# Altium schematic sheet V1.0.SchDoc
size 254 x 101 mm; PageSetup: Record=PageOptions|CenterHorizontal=True|CenterVertical=True|PrintScale=0.71|XCorrection=1.00|YCorrection=1.00|PrintKind=1|BorderSize=5000000|LeftOffset=0|BottomOffset=0|Orientation=2|PaperLength=1000|PaperWidth=1000|Scale=100|PaperSource=15|PrintQuality=4000|MediaType=1|DitherType=10|PrintScaleMode=1|PaperKind=A4|PaperIndex=9
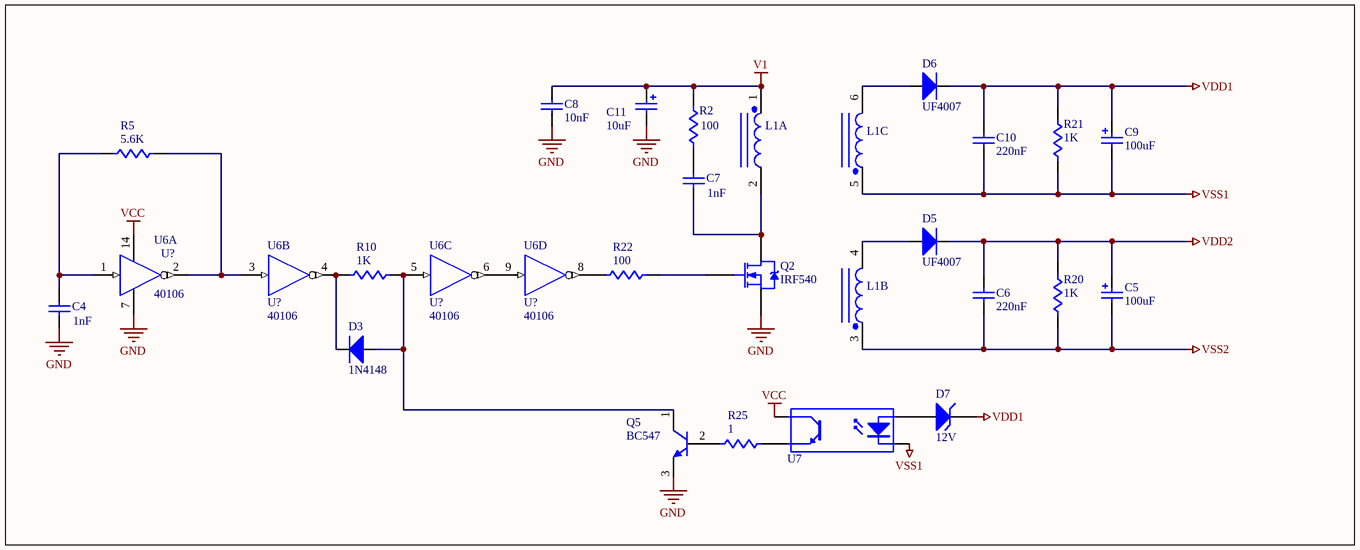
[diagram p0: V1.0.SchDoc]

## Parts
C4  value 1nF  [CAPNTO2.54-3.05x1.78A]  (hidden comment: Cap)
C5  value 100uF  [CAPPR2.5-6.3x5]  (hidden comment: Cap Pol1)
C6  value 220nF  [CAPNTO5.08-7.37x3.94]  (hidden comment: Cap)
C7  value 1nF  [CAPNTO2.54-3.56x2.03]  (hidden comment: Cap)
C8  value 10nF  [CAPNTO2.54-3.05x1.78A]  (hidden comment: Cap)
C9  value 100uF  [CAPPR2.5-6.3x5]  (hidden comment: Cap Pol1)
C10  value 220nF  [CAPNTO5.08-7.37x3.94]  (hidden comment: Cap)
C11  value 10uF  [CAPPR2.5-6.3x5]  (hidden comment: Cap Pol1)
D3  1N4148  [DIODE0.2_]
D5  UF4007  [DIODE-0.4]
D6  UF4007  [DIODE-0.4]
D7  value 12V  [DIODE-0.4]  (hidden comment: D Zener)
L1  Inductor 2*3  [INDUCTOR3]  (value not drawn)  (parts A,B,C of 3)
Q2  IRF540  [TO220V]
Q5  value BC547  [TO92C]  (hidden comment: NPN)
R2  value 100  [HDR1X2]  (hidden comment: Res1)
R5  value 5.6K  [HDR1X2]  (hidden comment: Res1)
R10  value 1K  [HDR1X2]  (hidden comment: Res1)
R20  value 1K  [HDR1X2]  (hidden comment: Res1)
R21  value 1K  [HDR1X2]  (hidden comment: Res1)
R22  value 100  [HDR1X2]  (hidden comment: Res1)
R25  value 1  [AXIAL-0.4]  (hidden comment: Res1)
U6  U?  value 40106  [DIP14]  (parts A,B,C,D of 6)
U7  Optoisolator1  [DIP-4]  (value not drawn)

## Nets
GND: C4.1 C8.1 C11.2 Q2.3(S) Q5.3(E) U6.7(VSS)
V1: C8.2 C11.1 L1.1 R2.1
VCC: U6.14(VDD) U7.4(C)
VDD1: C9.1 C10.2 D6.2(K) D7.2(K) R21.1
VDD2: C5.1 C6.2 D5.2(K) R20.1
VSS1: C9.2 C10.1 L1.5 R21.2 U7.2(K)
VSS2: C5.2 C6.1 L1.3 R20.2
NetC4_2: C4.2 R5.2 U6.1(I)
NetC7_1: C7.1 L1.2 Q2.2(D)
NetC7_2: C7.2 R2.2
NetD3_1: D3.1(A) Q5.1(C) R10.1 U6.5(I)
NetD3_2: D3.2(K) R10.2 U6.4(~{O})
NetD5_1: D5.1(A) L1.4
NetD6_1: D6.1(A) L1.6
NetD7_1: D7.1(A) U7.1(A)
NetQ2_1: Q2.1(G) R22.2
NetQ5_2: Q5.2(B) R25.1
NetR5_1: R5.1 U6.2(~{O}) U6.3(I)
NetR22_1: R22.1 U6.8(~{O})
NetR25_2: R25.2 U7.3(E)
NetU6_6: U6.6(~{O}) U6.9(I)

## Library data of the parts
C4 C6-C8 C10 = Cap: Capacitor; Manufacturer: Generic Components; Class I: Passive; Published: 8-Jun-2000; Revision: July-2002: Re-released for DXP Platform.; Publisher: Altium Limited; Class II: Capacitor
C5 C9 C11 = Cap Pol1: Polarized Capacitor (Radial); Manufacturer: Generic Components; Class I: Passive; Published: 8-Jun-2000; Revision: July-2002: Re-released for DXP Platform.; Publisher: Altium Limited; Class II: Capacitor
D3 D5 D6 = Diode: Default Diode; Manufacturer: Generic Components; Class I: Discrete; Class II: Diode - Switching; Published: 8-Jun-2000; Revision: July-2002: Re-released for DXP Platform.; Publisher: Altium Limited
D7 = D Zener: Zener Diode; Manufacturer: Generic Components; Class I: Discrete; Class II: Diode - Zener; Published: 8-Jun-2000; Revision: July-2002: Re-released for DXP Platform.; Publisher: Altium Limited
Q2 = IRFP141: 31A, 80V, 0.077 Ohm, N-Channel Power MOSFET; Note: Pin 2 (drain) is electrically connected to the case metal; Published: 8-Jun-2000; LatestRevisionDate: 17-Jul-2002; LatestRevisionNote: Re-released for DXP Platform.; DatasheetVersion: Jan-1998; PackageVersion: 1994; PackageReference: TO-247; Publisher: Altium Limited; PackageDescription: SIP with Mounting Hole; 3 Leads; Body 20.6 x 15.6 x 4.7 mm (typ); Pitch 5.56 mm; ComponentLink1Description: Manufacturer Link; ComponentLink1URL: http://www.intersil.com/cda/home/
Q5 = NPN: NPN Bipolar Transistor; Manufacturer: Generic Components; Class I: Discrete; Class II: BJT - Low Power; Published: 8-Jun-2000; Revision: July-2002: Re-released for DXP Platform.; Publisher: Altium Limited
R2 R5 R10 R20-R22 R25 = Res1: Resistor; Manufacturer: Generic Components; Class I: Passive; Published: 8-Jun-2000; Revision: July-2002: Re-released for DXP Platform.; Publisher: Altium Limited; Class II: Resistor
U6 = 40106: Hex inverting Schmitt trigger, 14-Pin; Publisher: Altium Limited; ComponentLink1URL: http://www.nxp.com
U7 = Optoisolator1: 4-Pin Phototransistor Optocoupler; Published: 24-Mar-1999; LatestRevisionDate: 04-Mar-2005; LatestRevisionNote: Sch pins 3 & 4 Swapped.; DatasheetVersion: Nov-2003; PackageReference: DIP-4; Publisher: Altium Limited
L1 = Inductor 2*3: Publisher: Altium Limited